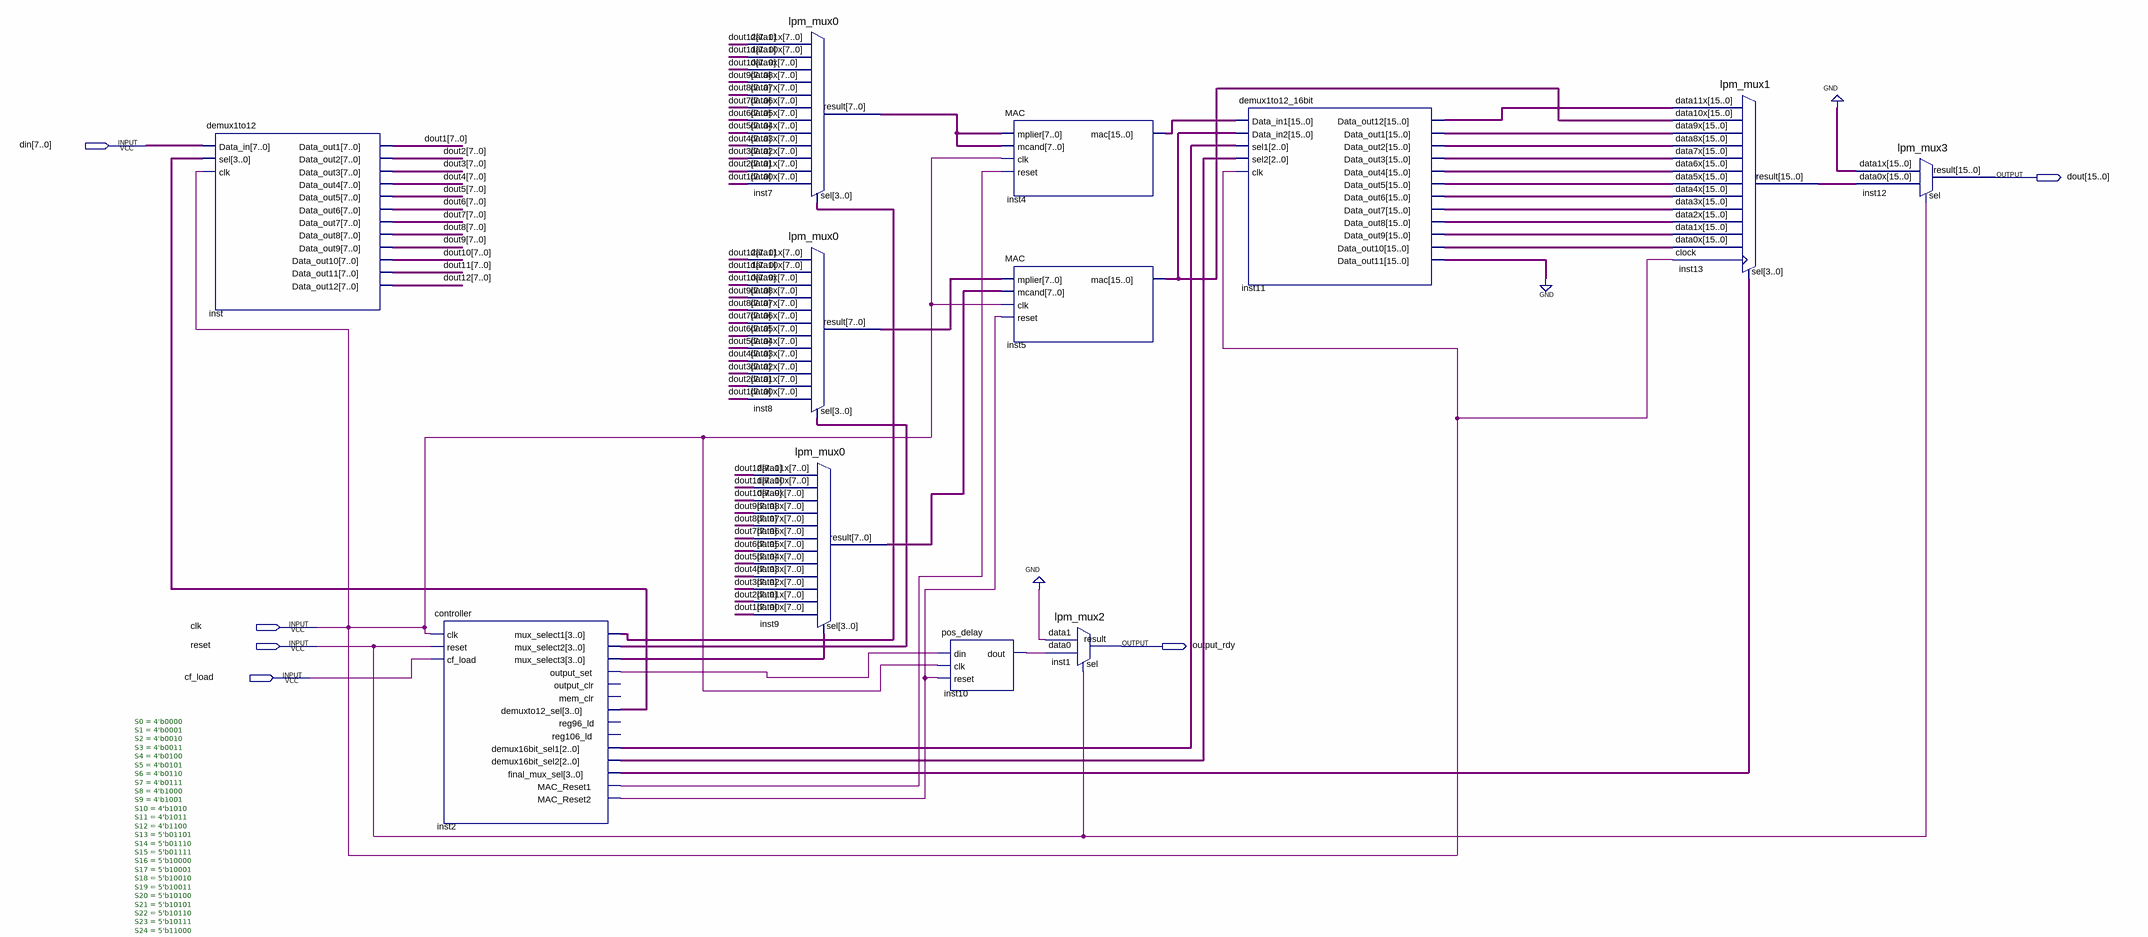
[diagram p0: schematic sheet]
// Quartus schematic transmult.bdf as structural Verilog: 12 symbols, 6 pins
module transmult (
  input  [7:0] din,
  input  clk,
  input  reset,
  input  cf_load,
  output [15:0] dout,
  output output_rdy
);

  wire inst2_mac_reset1, inst2_mac_reset2, inst2_output_set, inst10_dout;
  wire [2:0] inst2_demux16bit_sel1, inst2_demux16bit_sel2;
  wire [3:0] inst2_demuxto12_sel, inst2_final_mux_sel, inst2_mux_select1, inst2_mux_select2,
       inst2_mux_select3;
  wire [7:0] dout1, dout2, dout3, dout4, dout5, dout6, dout7, dout8, dout9, dout10, dout11, dout12,
       inst7_result, inst8_result, inst9_result;
  wire [15:0] inst4_mac, inst5_mac, inst11_data_out1, inst11_data_out2, inst11_data_out3, inst11_data_out4,
       inst11_data_out5, inst11_data_out6, inst11_data_out7, inst11_data_out8, inst11_data_out9,
       inst11_data_out10, inst11_data_out11, inst11_data_out12, inst13_result;

  demux1to12 inst (
    .Data_in(din), .sel(inst2_demuxto12_sel), .clk(clk), .Data_out1(dout1), .Data_out2(dout2),
    .Data_out3(dout3), .Data_out4(dout4), .Data_out5(dout5), .Data_out6(dout6), .Data_out7(dout7),
    .Data_out8(dout8), .Data_out9(dout9), .Data_out10(dout10), .Data_out11(dout11), .Data_out12(dout12));
  controller #(.S0(4'b0000), .S1(4'b0001), .S2(4'b0010), .S3(4'b0011), .S4(4'b0100), .S5(4'b0101), .S6(4'b0110), .S7(4'b0111), .S8(4'b1000), .S9(4'b1001), .S10(4'b1010), .S11(4'b1011), .S12(4'b1100), .S13(5'b01101), .S14(5'b01110), .S15(5'b01111), .S16(5'b10000), .S17(5'b10001), .S18(5'b10010), .S19(5'b10011), .S20(5'b10100), .S21(5'b10101), .S22(5'b10110), .S23(5'b10111), .S24(5'b11000)) inst2 (
    .clk(clk), .reset(reset), .cf_load(cf_load), .mux_select1(inst2_mux_select1),
    .mux_select2(inst2_mux_select2), .mux_select3(inst2_mux_select3), .output_set(inst2_output_set),
    .demuxto12_sel(inst2_demuxto12_sel), .demux16bit_sel1(inst2_demux16bit_sel1),
    .demux16bit_sel2(inst2_demux16bit_sel2), .final_mux_sel(inst2_final_mux_sel),
    .MAC_Reset1(inst2_mac_reset1), .MAC_Reset2(inst2_mac_reset2));  // open: output_clr, mem_clr, reg96_ld, reg106_ld
  lpm_mux0 inst7 (
    .data11x(dout12), .data10x(dout11), .data9x(dout10), .data8x(dout9), .data7x(dout8), .data6x(dout7),
    .data5x(dout6), .data4x(dout5), .data3x(dout4), .data2x(dout3), .data1x(dout2), .data0x(dout1),
    .sel(inst2_mux_select1), .result(inst7_result));
  lpm_mux0 inst8 (
    .data11x(dout12), .data10x(dout11), .data9x(dout10), .data8x(dout9), .data7x(dout8), .data6x(dout7),
    .data5x(dout6), .data4x(dout5), .data3x(dout4), .data2x(dout3), .data1x(dout2), .data0x(dout1),
    .sel(inst2_mux_select2), .result(inst8_result));
  lpm_mux0 inst9 (
    .data11x(dout12), .data10x(dout11), .data9x(dout10), .data8x(dout9), .data7x(dout8), .data6x(dout7),
    .data5x(dout6), .data4x(dout5), .data3x(dout4), .data2x(dout3), .data1x(dout2), .data0x(dout1),
    .sel(inst2_mux_select3), .result(inst9_result));
  pos_delay inst10 (.din(inst2_output_set), .clk(clk), .reset(inst2_mac_reset2), .dout(inst10_dout));
  MAC inst4 (.mplier(inst7_result), .mcand(inst7_result), .clk(clk), .reset(inst2_mac_reset1), .mac(inst4_mac));
  MAC inst5 (.mplier(inst8_result), .mcand(inst9_result), .clk(clk), .reset(inst2_mac_reset2), .mac(inst5_mac));
  lpm_mux2 inst1 (.data1(1'b0), .data0(inst10_dout), .sel(reset), .result(output_rdy));
  demux1to12_16bit inst11 (
    .Data_in1(inst4_mac), .Data_in2(inst5_mac), .sel1(inst2_demux16bit_sel1), .sel2(inst2_demux16bit_sel2),
    .clk(clk), .Data_out12(inst11_data_out12), .Data_out1(inst11_data_out1), .Data_out2(inst11_data_out2),
    .Data_out3(inst11_data_out3), .Data_out4(inst11_data_out4), .Data_out5(inst11_data_out5),
    .Data_out6(inst11_data_out6), .Data_out7(inst11_data_out7), .Data_out8(inst11_data_out8),
    .Data_out9(inst11_data_out9), .Data_out10(inst11_data_out10), .Data_out11(inst11_data_out11));
  lpm_mux1 inst13 (
    .data11x(inst11_data_out12), .data10x(inst5_mac), .data9x(inst11_data_out1), .data8x(inst11_data_out2),
    .data7x(inst11_data_out3), .data6x(inst11_data_out4), .data5x(inst11_data_out5),
    .data4x(inst11_data_out6), .data3x(inst11_data_out7), .data2x(inst11_data_out8),
    .data1x(inst11_data_out9), .data0x(inst11_data_out10), .clock(clk), .sel(inst2_final_mux_sel),
    .result(inst13_result));
  lpm_mux3 inst12 (.data1x({16{1'b0}}), .data0x(inst13_result), .sel(reset), .result(dout));
  // also tied to GND on the sheet: {inst11_data_out11[0], inst11_data_out11[1], inst11_data_out11[2], inst11_data_out11[3], inst11_data_out11[4], inst11_data_out11[5], inst11_data_out11[6], inst11_data_out11[7], inst11_data_out11[8], inst11_data_out11[9], inst11_data_out11[10], inst11_data_out11[11], inst11_data_out11[12], inst11_data_out11[13], inst11_data_out11[14], inst11_data_out11[15]}
endmodule
